# Altium schematic sheet DIAGGRAM.SchDoc
size A4
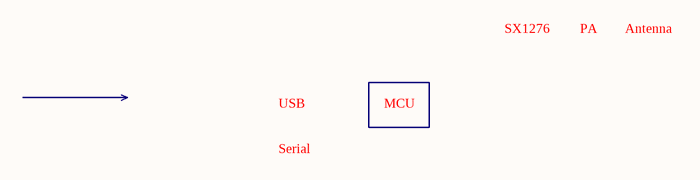
[diagram p0: DIAGGRAM.SchDoc]

## Notes on the sheet
- SX1276
- PA
- Antenna
- USB
- Serial
- MCU